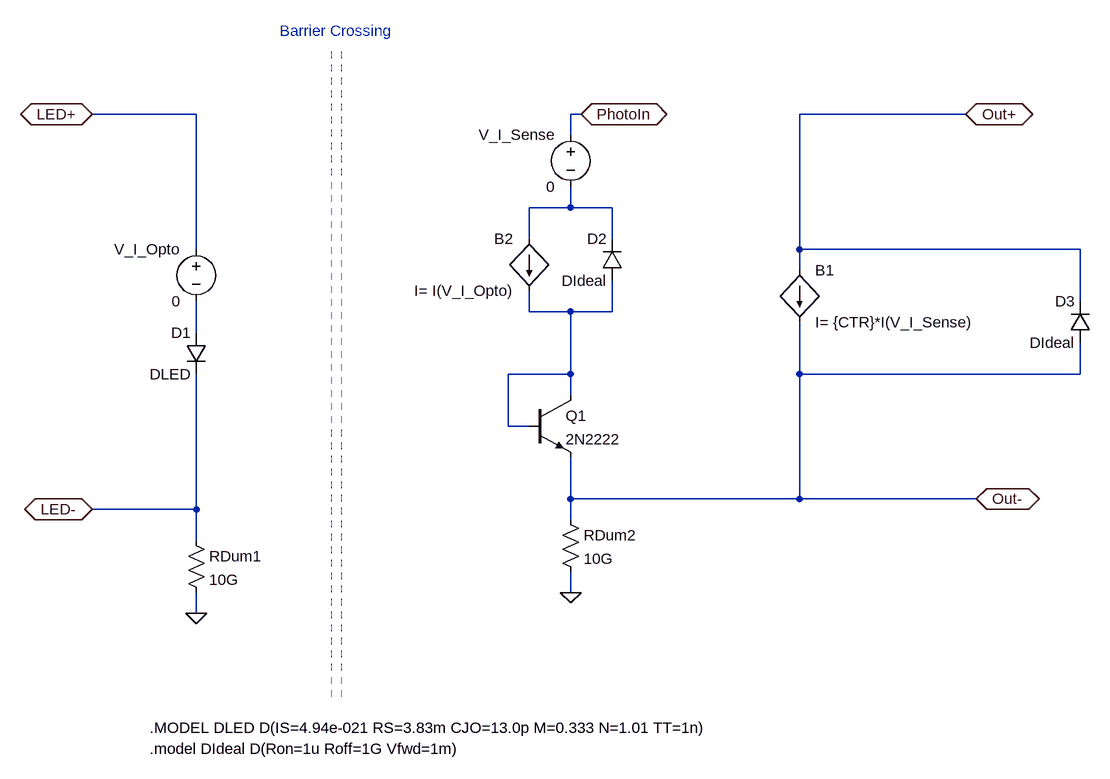
[diagram p0: schematic Opto_Generic_5pins.asc]
Opto_Generic_5pins.asc, the LTspice schematic file:
Version 4.1
SHEET 1 948 1008
WIRE -432 0 -592 0
WIRE 160 0 144 0
WIRE 752 0 496 0
WIRE 144 32 144 0
WIRE 144 144 144 112
WIRE 144 144 80 144
WIRE 208 144 144 144
WIRE 80 192 80 144
WIRE 208 192 208 144
WIRE -432 208 -432 0
WIRE 496 208 496 0
WIRE 928 208 496 208
WIRE 496 240 496 208
WIRE 928 288 928 208
WIRE 80 304 80 272
WIRE 144 304 80 304
WIRE 208 304 208 256
WIRE 208 304 144 304
WIRE -432 336 -432 288
WIRE 144 400 144 304
WIRE 144 400 48 400
WIRE 496 400 496 320
WIRE 928 400 928 352
WIRE 928 400 496 400
WIRE 144 432 144 400
WIRE 48 480 48 400
WIRE 80 480 48 480
WIRE 144 592 144 528
WIRE 496 592 496 400
WIRE 496 592 144 592
WIRE 768 592 496 592
WIRE -432 608 -432 400
WIRE -432 608 -592 608
WIRE 144 624 144 592
WIRE -432 656 -432 608
WIRE 144 736 144 704
WIRE -432 768 -432 736
FLAG -432 768 0
FLAG 144 736 0
FLAG -592 0 LED+
IOPIN -592 0 BiDir
FLAG -592 608 LED-
IOPIN -592 608 BiDir
FLAG 160 0 PhotoIn
IOPIN 160 0 BiDir
FLAG 768 592 Out-
IOPIN 768 592 BiDir
FLAG 752 0 Out+
IOPIN 752 0 BiDir
SYMBOL diode -416 336 M0
SYMATTR InstName D1
SYMATTR Value DLED
SYMBOL voltage -432 192 M0
WINDOW 123 0 0 Left 0
WINDOW 39 0 0 Left 0
SYMATTR InstName V_I_Opto
SYMATTR Value 0
SYMBOL bi 496 240 R0
SYMATTR InstName B1
SYMATTR Value I= {CTR}*I(V_I_Sense)
SYMBOL bi 80 192 M0
SYMATTR InstName B2
SYMATTR Value I= I(V_I_Opto)
SYMBOL diode 224 256 R180
WINDOW 0 24 64 Left 2
WINDOW 3 24 0 Left 2
SYMATTR InstName D2
SYMATTR Value DIdeal
SYMBOL voltage 144 16 M0
WINDOW 123 0 0 Left 0
WINDOW 39 0 0 Left 0
SYMATTR InstName V_I_Sense
SYMATTR Value 0
SYMBOL npn 80 432 R0
SYMATTR InstName Q1
SYMATTR Value 2N2222
SYMBOL res -448 640 R0
SYMATTR InstName RDum1
SYMATTR Value 10G
SYMBOL res 128 608 R0
SYMATTR InstName RDum2
SYMATTR Value 10G
SYMBOL diode 944 352 R180
WINDOW 0 24 64 Left 2
WINDOW 3 24 0 Left 2
SYMATTR InstName D3
SYMATTR Value DIdeal
TEXT -504 944 Left 2 !.MODEL DLED D(IS=4.94e-021 RS=3.83m CJO=13.0p M=0.333 N=1.01 TT=1n)
TEXT -504 976 Left 2 !.model DIdeal D(Ron=1u Roff=1G Vfwd=1m)
TEXT -304 -128 Left 2 ;Barrier Crossing
LINE Normal -224 896 -224 -96 1
LINE Normal -224 896 -224 896 1
LINE Normal -208 896 -208 -96 1

The netlist it stands for:
* Opto_Generic_5pins.asc
D1 N003 LED- DLED
V_I_Opto LED+ N003 0
B1 Out+ Out- I= {CTR}*I(V_I_Sense)
B2 N001 N002 I= I(V_I_Opto)
D2 N002 N001 DIdeal
V_I_Sense PhotoIn N001 0
Q1 N002 N002 Out- 0 2N2222
RDum1 LED- 0 10G
RDum2 Out- 0 10G
D3 Out- Out+ DIdeal
.model D D
.lib standard.dio
.model NPN NPN
.model PNP PNP
.lib standard.bjt
.MODEL DLED D(IS=4.94e-021 RS=3.83m CJO=13.0p M=0.333 N=1.01 TT=1n)
.model DIdeal D(Ron=1u Roff=1G Vfwd=1m)
* Barrier Crossing
.backanno
.end